# EasyEDA Pro project Pai_zhen_Pin.eprj

# Schematic Schematic1
Board Name: Board1; Create Date: 2026-05-11; Page Name: P1; Project Name: Pai_zhen_Pin; Schematic Name: Schematic1; Update Date: 2026-05-11; Company: 嘉立创EDA; Page Size: A4; Version: V1.0
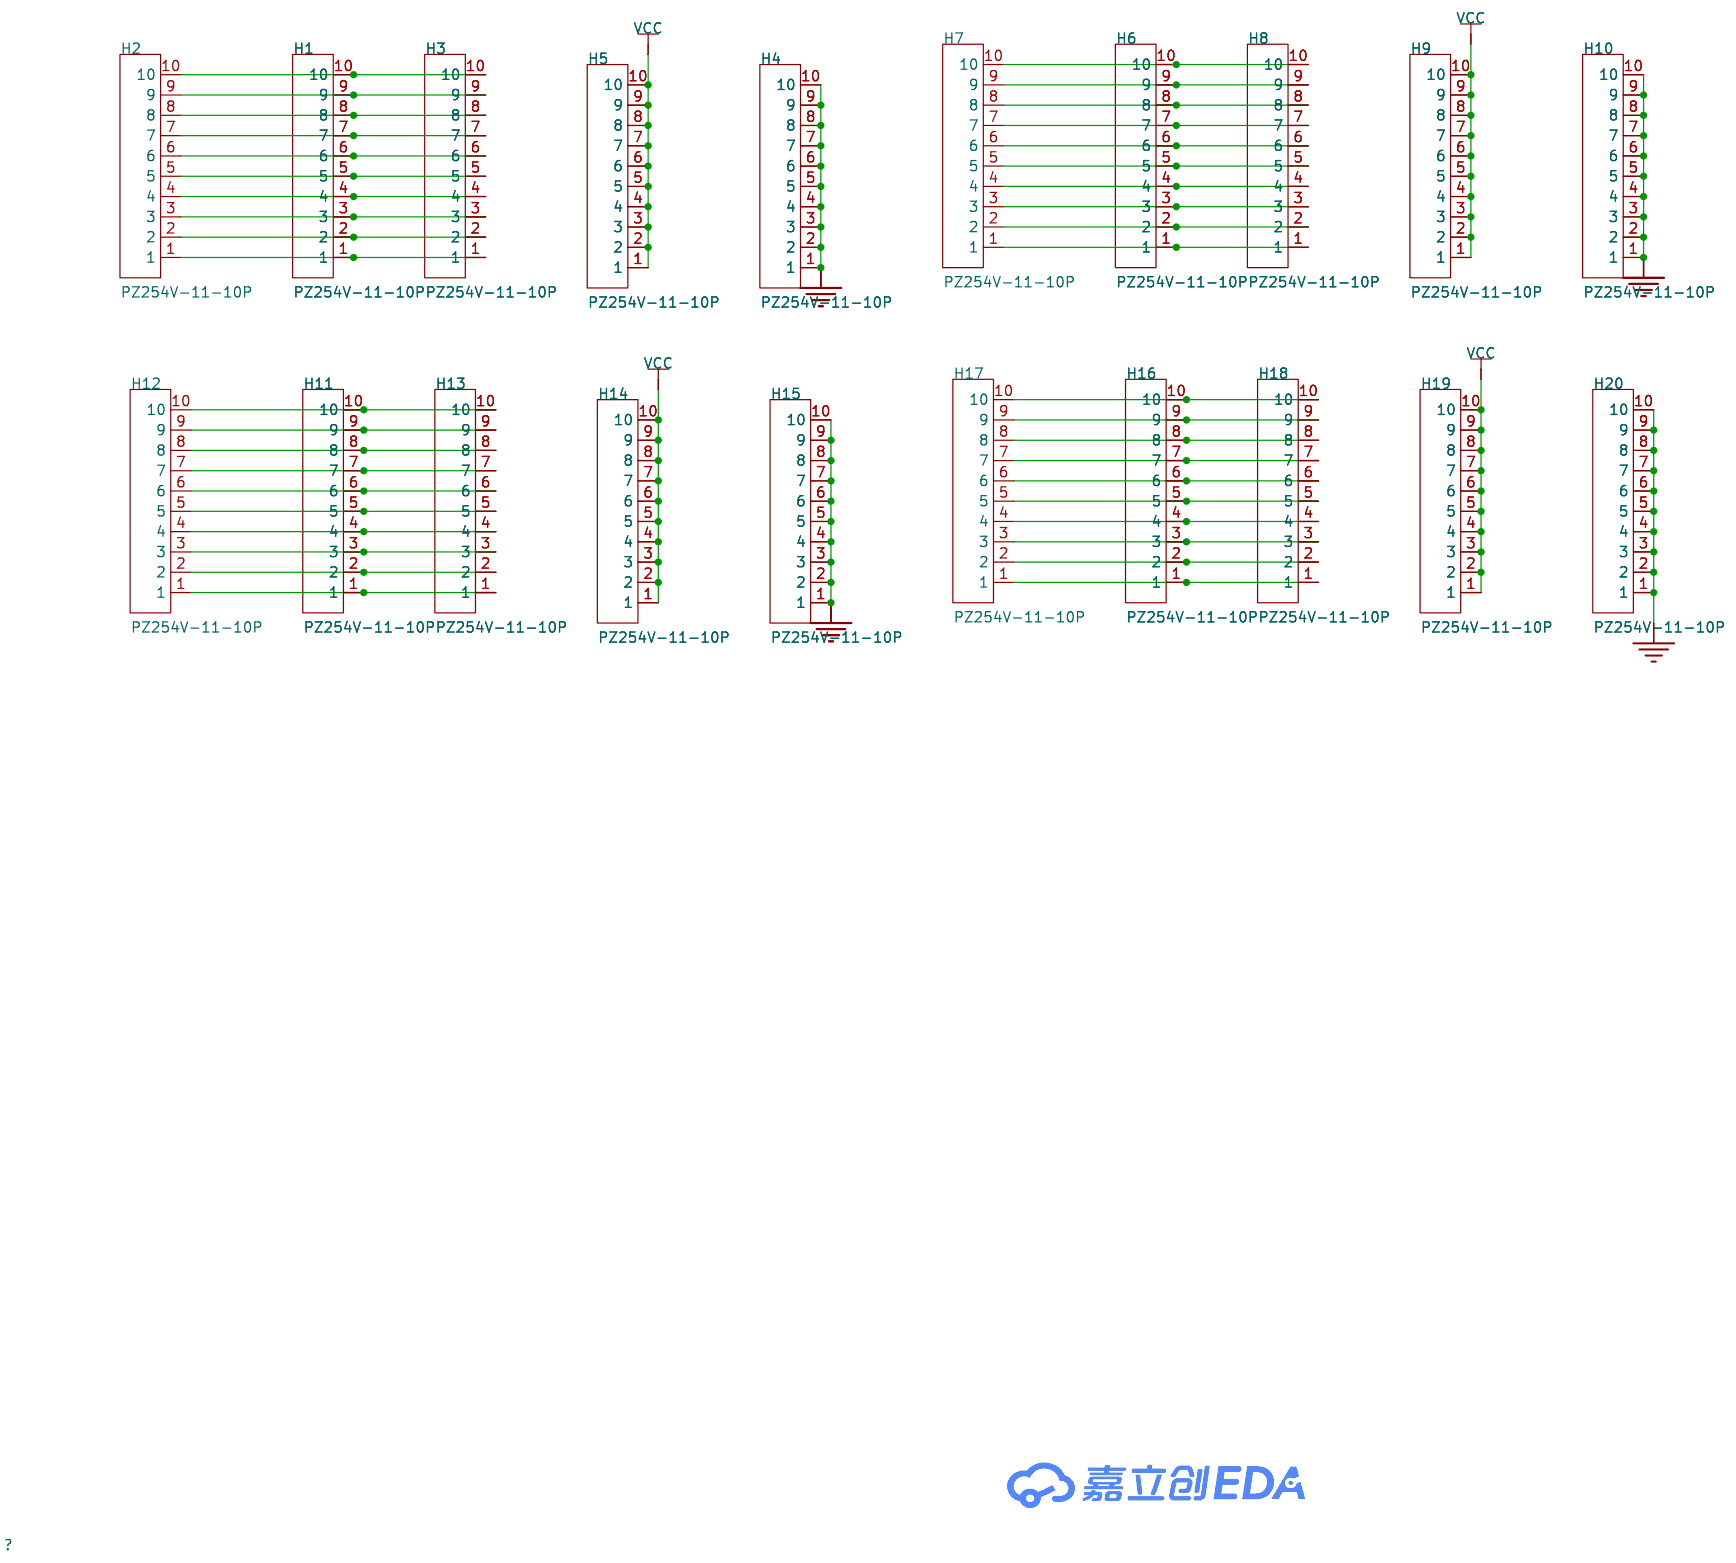
[diagram p0: schematic sheet]

## Parts
H1  PZ254V-11-10P  [HDR-TH_10P-P2.54-V-M]
H2  PZ254V-11-10P  [HDR-TH_10P-P2.54-V-M]
H3  PZ254V-11-10P  [HDR-TH_10P-P2.54-V-M]
H4  PZ254V-11-10P  [HDR-TH_10P-P2.54-V-M]
H5  PZ254V-11-10P  [HDR-TH_10P-P2.54-V-M]
H6  PZ254V-11-10P  [HDR-TH_10P-P2.54-V-M]
H7  PZ254V-11-10P  [HDR-TH_10P-P2.54-V-M]
H8  PZ254V-11-10P  [HDR-TH_10P-P2.54-V-M]
H9  PZ254V-11-10P  [HDR-TH_10P-P2.54-V-M]
H10  PZ254V-11-10P  [HDR-TH_10P-P2.54-V-M]
H11  PZ254V-11-10P  [HDR-TH_10P-P2.54-V-M]
H12  PZ254V-11-10P  [HDR-TH_10P-P2.54-V-M]
H13  PZ254V-11-10P  [HDR-TH_10P-P2.54-V-M]
H14  PZ254V-11-10P  [HDR-TH_10P-P2.54-V-M]
H15  PZ254V-11-10P  [HDR-TH_10P-P2.54-V-M]
H16  PZ254V-11-10P  [HDR-TH_10P-P2.54-V-M]
H17  PZ254V-11-10P  [HDR-TH_10P-P2.54-V-M]
H18  PZ254V-11-10P  [HDR-TH_10P-P2.54-V-M]
H19  PZ254V-11-10P  [HDR-TH_10P-P2.54-V-M]
H20  PZ254V-11-10P  [HDR-TH_10P-P2.54-V-M]

## Library data of the parts
H1-H20 = PZ254V-11-10P: LCSC Part Name: 1x10P 间距:2.54mm 方针 直插; Supplier Part: C492409; Manufacturer: XFCN(兴飞); Supplier Footprint: 插件,P=2.54mm; JLCPCB Part Class: 扩展库; Datasheet: https://item.szlcsc.com/datasheet/PZ254V-11-10P/502965.html; Supplier: LCSC; Pin Structure: 1x10P; Pitch: 2.54mm; Circluar Pins/Square Pins: 方针; Mounting Type: 直插; Number of Rows: 单排; Number of Pins: 10P; Current Rating: 3A; Voltage Rating (Max): 250V; Length of Mating Pin: 6mm; Insulation Height: 2.5mm; Length of End Connection Pin: 3mm; Contact Material: 黄铜; Operating Temperature: -40℃~+105℃; Color: 黑色

## Nets
GND: H4.1 H4.2 H4.3 H4.4 H4.5 H4.6 H4.7 H4.8 H4.9 H4.10 H10.1 H10.2 H10.3 H10.4 H10.5 H10.6 H10.7 H10.8 H10.9 H10.10 H15.1 H15.2 H15.3 H15.4 H15.5 H15.6 H15.7 H15.8 H15.9 H15.10 H20.1 H20.2 H20.3 H20.4 H20.5 H20.6 H20.7 H20.8 H20.9 H20.10
VCC: H5.1 H5.2 H5.3 H5.4 H5.5 H5.6 H5.7 H5.8 H5.9 H5.10 H9.1 H9.2 H9.3 H9.4 H9.5 H9.6 H9.7 H9.8 H9.9 H9.10 H14.1 H14.2 H14.3 H14.4 H14.5 H14.6 H14.7 H14.8 H14.9 H14.10 H19.1 H19.2 H19.3 H19.4 H19.5 H19.6 H19.7 H19.8 H19.9 H19.10
$1N1061: H1.10 H2.10 H3.10
$1N1066: H1.9 H2.9 H3.9
$1N1071: H1.8 H2.8 H3.8
$1N1076: H1.7 H2.7 H3.7
$1N1126: H1.6 H2.6 H3.6
$1N1138: H1.5 H2.5 H3.5
$1N1143: H1.4 H2.4 H3.4
$1N1170: H1.3 H2.3 H3.3
$1N1182: H1.2 H2.2 H3.2
$1N1195: H1.1 H2.1 H3.1
$1N2869: H6.1 H7.1 H8.1
$1N2872: H6.2 H7.2 H8.2
$1N2875: H6.8 H7.8 H8.8
$1N2878: H6.7 H7.7 H8.7
$1N2881: H6.6 H7.6 H8.6
$1N2884: H6.10 H7.10 H8.10
$1N2887: H6.9 H7.9 H8.9
$1N2890: H6.3 H7.3 H8.3
$1N2893: H6.5 H7.5 H8.5
$1N2896: H6.4 H7.4 H8.4
$1N3709: H16.6 H17.6 H18.6
$1N3712: H16.5 H17.5 H18.5
$1N3715: H16.4 H17.4 H18.4
$1N3718: H16.7 H17.7 H18.7
$1N3721: H16.3 H17.3 H18.3
$1N3724: H16.10 H17.10 H18.10
$1N3727: H16.9 H17.9 H18.9
$1N3730: H16.8 H17.8 H18.8
$1N3733: H16.1 H17.1 H18.1
$1N3736: H16.2 H17.2 H18.2
$1N3739: H11.1 H12.1 H13.1
$1N3742: H11.2 H12.2 H13.2
$1N3745: H11.8 H12.8 H13.8
$1N3748: H11.7 H12.7 H13.7
$1N3751: H11.6 H12.6 H13.6
$1N3754: H11.10 H12.10 H13.10
$1N3757: H11.9 H12.9 H13.9
$1N3760: H11.3 H12.3 H13.3
$1N3763: H11.5 H12.5 H13.5
$1N3766: H11.4 H12.4 H13.4

# Board PCB1
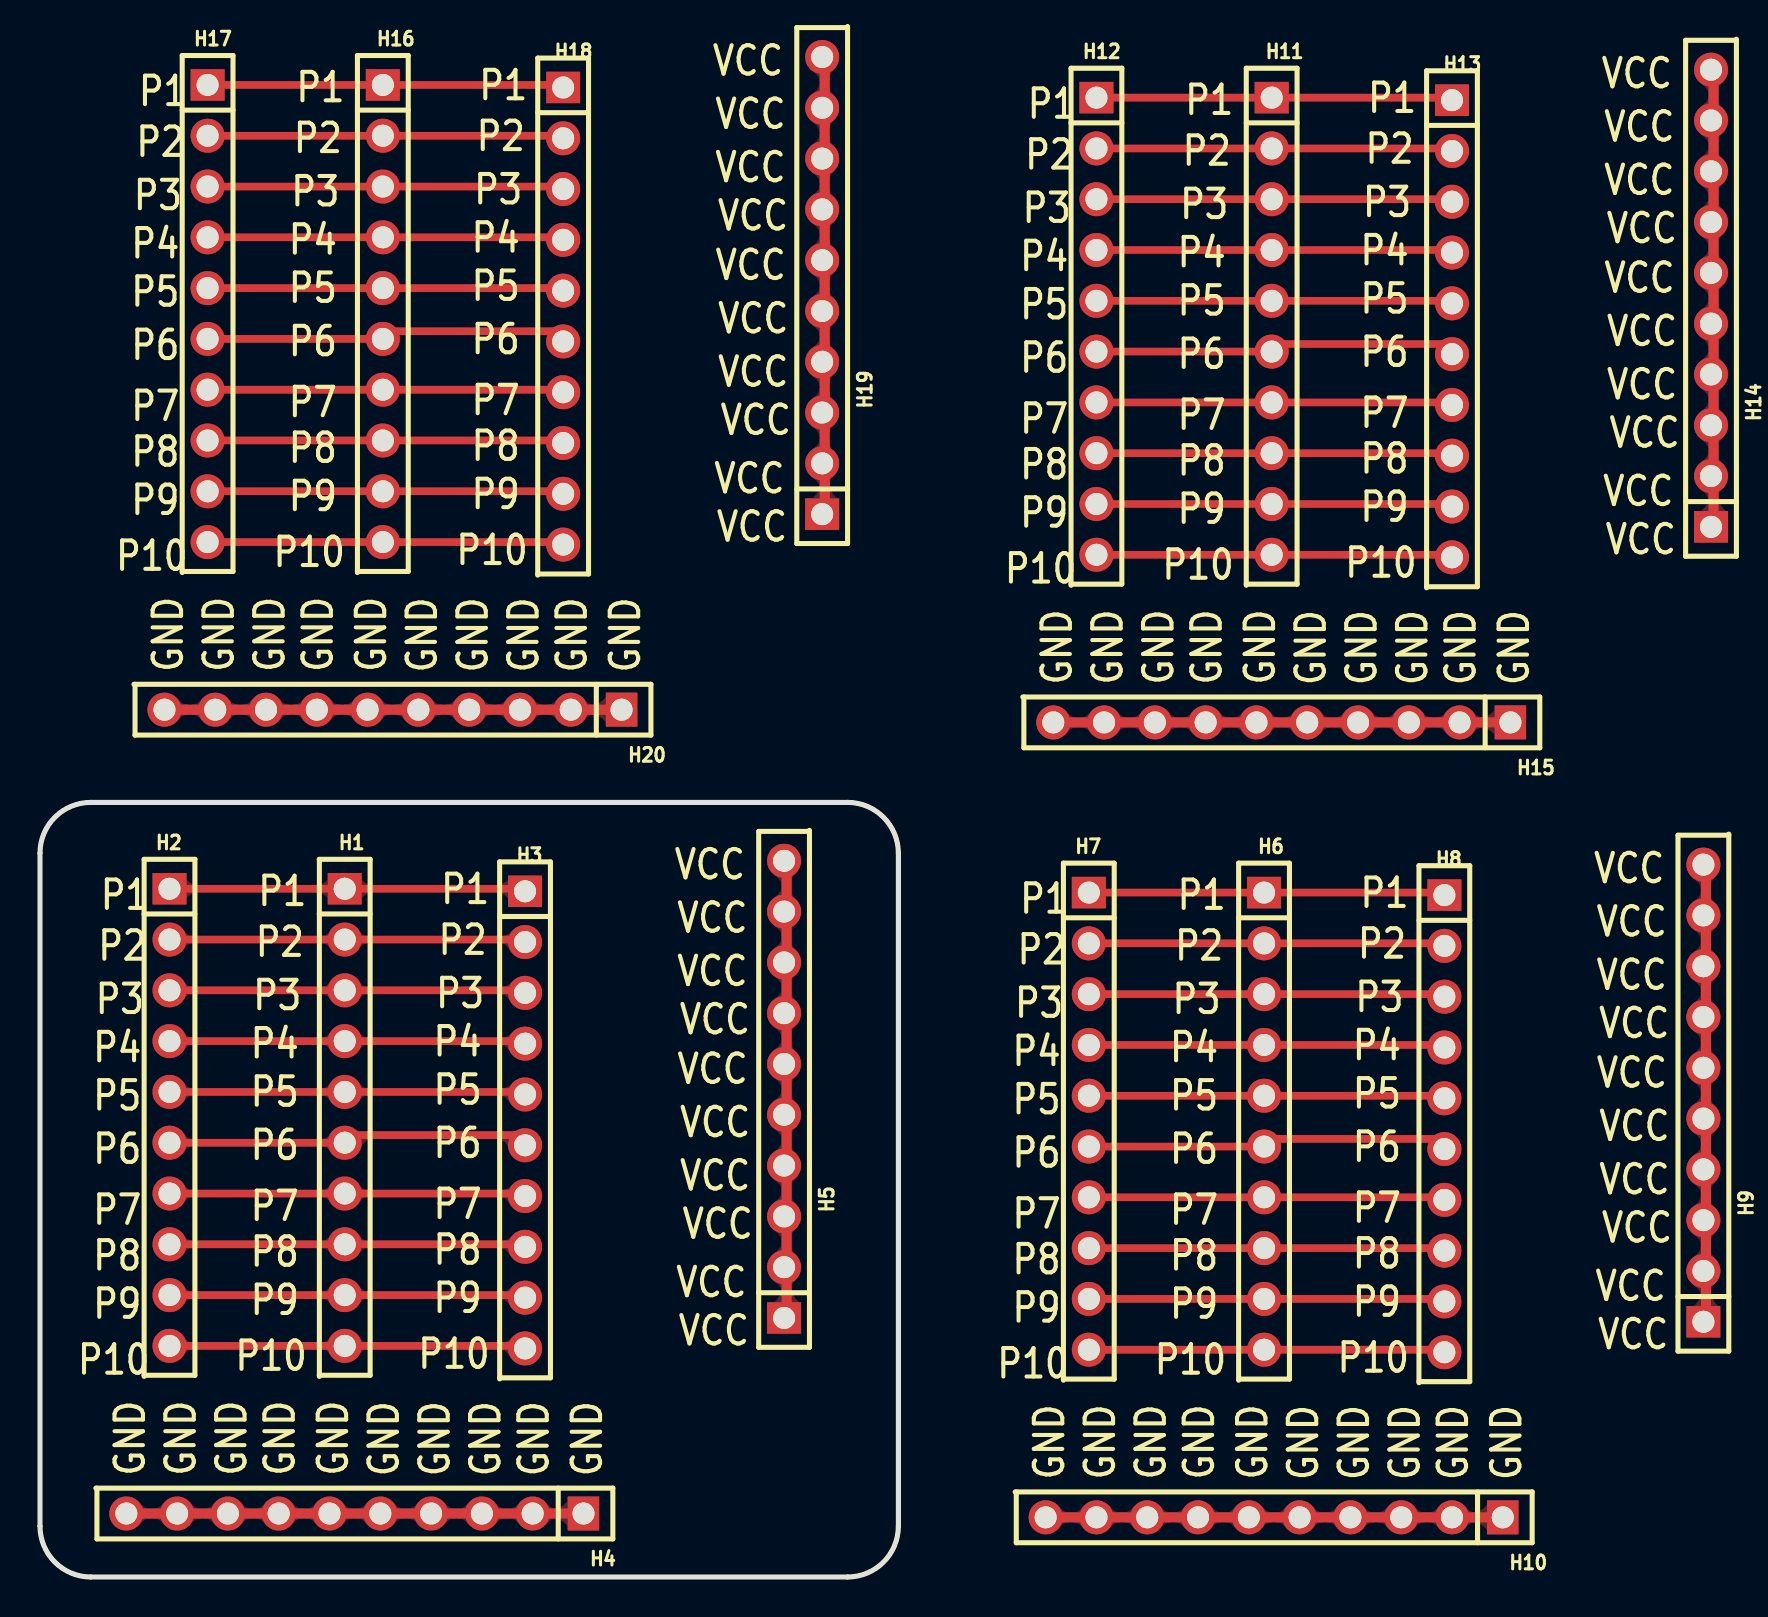
[diagram p1: board, top side]
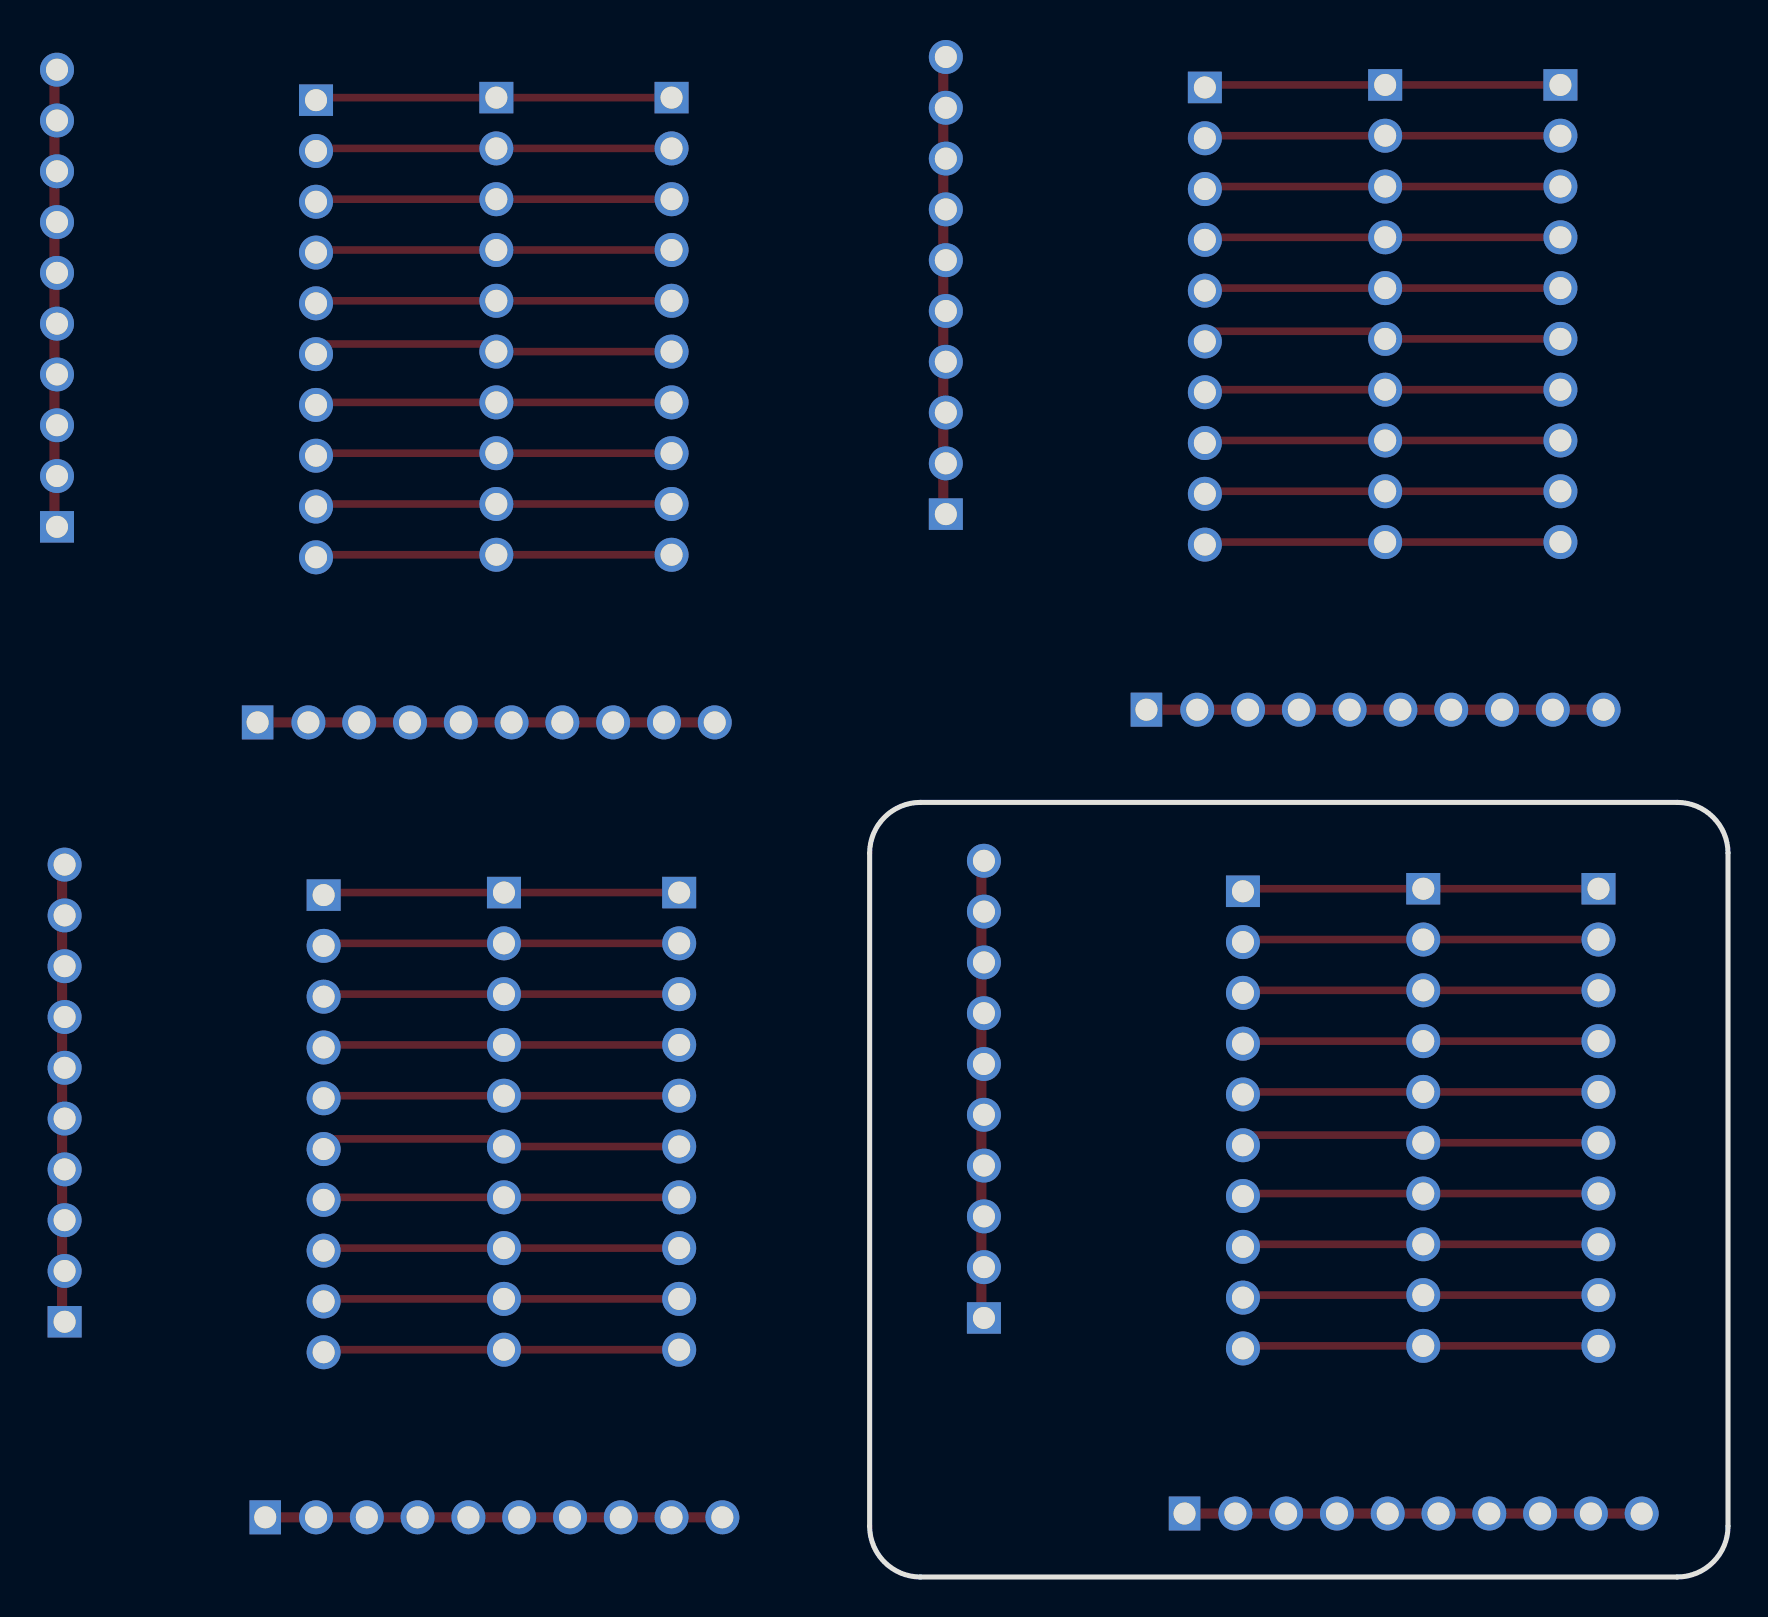
[diagram p2: board, bottom side, seen from below]

Outline 42.93 x 38.73 mm; copper layers: Top Layer, Bottom Layer. Coordinates in mm from the lower left corner of the outline.
Outline path: 0,36.19 0,2.54 arc(0.74,0.74) 2.54,0 40.39,0 arc(42.18,0.74) 42.93,2.54 42.93,36.19 arc(42.18,37.99) 40.39,38.73 2.54,38.73 arc(0.74,37.99) 0,36.19
Stack: Top Layer 0.035mm / Dielectric1 1.51mm FR4 er 4.5 / Bottom Layer 0.035mm

## Design rules (mm)
template: JLCPCB Capability(Two Layers Board)
spacing copperThickness1oz (default): track to track 0.102, other pairs 0.152 to 0.3
spacing copperThickness2oz: track to track 0.203, other pairs 0.152 to 0.3
track width copperThickness1oz (default): min 0.127, default 0.254, max 2.54
track width copperThickness2oz: min 0.203, default 0.254, max 2.54
differential pair differentialPair (default): width min 0.127, default 0.254, max 2.54; gap min 0.152, default 0.152
via viaSize (default): diameter min 0.5, default 0.61, max 10; hole min 0.3, default 0.305, max 6.3

## Placement (name value [footprint] x y rotation side)
H1  PZ254V-11-10P  [HDR-TH_10P-P2.54-V-M]  15.24 22.99 270 top
H2  PZ254V-11-10P  [HDR-TH_10P-P2.54-V-M]  6.48 22.99 270 top
H3  PZ254V-11-10P  [HDR-TH_10P-P2.54-V-M]  24.26 22.86 270 top
H4  PZ254V-11-10P  [HDR-TH_10P-P2.54-V-M]  15.75 3.17 180 top
H5  PZ254V-11-10P  [HDR-TH_10P-P2.54-V-M]  37.21 24.38 90 top
H6  PZ254V-11-10P  [HDR-TH_10P-P2.54-V-M]  61.21 22.8 270 top
H7  PZ254V-11-10P  [HDR-TH_10P-P2.54-V-M]  52.45 22.8 270 top
H8  PZ254V-11-10P  [HDR-TH_10P-P2.54-V-M]  70.23 22.67 270 top
H9  PZ254V-11-10P  [HDR-TH_10P-P2.54-V-M]  83.19 24.19 90 top
H10  PZ254V-11-10P  [HDR-TH_10P-P2.54-V-M]  61.72 2.98 180 top
H11  PZ254V-11-10P  [HDR-TH_10P-P2.54-V-M]  61.59 62.55 270 top
H12  PZ254V-11-10P  [HDR-TH_10P-P2.54-V-M]  52.83 62.55 270 top
H13  PZ254V-11-10P  [HDR-TH_10P-P2.54-V-M]  70.61 62.42 270 top
H14  PZ254V-11-10P  [HDR-TH_10P-P2.54-V-M]  83.57 63.94 90 top
H15  PZ254V-11-10P  [HDR-TH_10P-P2.54-V-M]  62.1 42.74 180 top
H16  PZ254V-11-10P  [HDR-TH_10P-P2.54-V-M]  17.15 63.18 270 top
H17  PZ254V-11-10P  [HDR-TH_10P-P2.54-V-M]  8.38 63.18 270 top
H18  PZ254V-11-10P  [HDR-TH_10P-P2.54-V-M]  26.16 63.06 270 top
H19  PZ254V-11-10P  [HDR-TH_10P-P2.54-V-M]  39.12 64.58 90 top
H20  PZ254V-11-10P  [HDR-TH_10P-P2.54-V-M]  17.65 43.37 180 top

## Footprints (pads in the part's own frame, mm; a bottom-side part is the same pattern mirrored in y, then rotated)
HDR-TH_10P-P2.54-V-M
  rect 1.575x1.7 hole 1.1: 1(-11.43,0)
  round 1.7 hole 1.1: 2(-8.89,0) 3(-6.35,0) 4(-3.81,0) 5(-1.27,0) 6(1.27,0) 7(3.81,0) 8(6.35,0) 9(8.89,0) 10(11.43,0)

## Nets
As in the schematic.

## Routing (per net, layer and track width the routed paths; a pad name or vN(x,y) marks a point on that pad's centre or on a via; arc(x,y) is an arc through that point)
GND: length 91.4
  Top Layer w0.508: H4.1 H4.2 H4.4 H4.5 H4.7 H4.8 4.32,3.17 ; H15.10 H15.9 H15.8 H15.7 H15.6 H15.5 H15.4 H15.3 H15.2 H15.1 ; 73.15,2.98 H10.2 H10.3 H10.4 H10.6 H10.7 H10.8 H10.10 ; H20.10 H20.9 H20.8 H20.7 H20.6 H20.5 H20.4 H20.3 H20.2 H20.1
VCC: length 91.4
  Top Layer w0.508: 37.34,35.81 37.34,12.95 ; 39.24,76.01 39.24,53.15 ; 83.31,35.62 83.31,12.76 ; 83.69,75.37 83.69,52.51
$1N1061: length 17.8
  Top Layer w0.381: H3.10 24.13,11.56 H1.10 H2.10
$1N1066: length 17.8
  Top Layer w0.381: H3.9 24.13,14.1 H1.9 H2.9
$1N1071: length 17.8
  Top Layer w0.381: H2.8 H1.8 24.13,16.64 H3.8
$1N1076: length 17.8
  Top Layer w0.381: H3.7 24.13,19.18 H1.7 H2.7
$1N1126: length 18.2
  Top Layer w0.381: H3.6 23.75,22.1 15.51,22.1 15.24,21.83 H1.6 H2.6
$1N1138: length 17.8
  Top Layer w0.381: H3.5 24.13,24.26 H1.5 H2.5
$1N1143: length 17.8
  Top Layer w0.381: H2.4 H1.4 24.13,26.8 H3.4
$1N1170: length 17.8
  Top Layer w0.381: H2.3 H1.3 24.13,29.34 H3.3
$1N1182: length 17.8
  Top Layer w0.381: H3.2 24.13,31.88 H1.2 H2.2
$1N1195: length 17.8
  Top Layer w0.381: H3.1 24.13,34.42 H1.1 H2.1
$1N2869: length 17.8
  Top Layer w0.381: H7.1 H6.1 70.1,34.23 H8.1
$1N2872: length 17.8
  Top Layer w0.381: H7.2 H6.2 70.1,31.69 H8.2
$1N2875: length 17.8
  Top Layer w0.381: H7.8 H6.8 70.1,16.45 H8.8
$1N2878: length 17.8
  Top Layer w0.381: H7.7 H6.7 70.1,18.99 H8.7
$1N2881: length 18.2
  Top Layer w0.381: H7.6 H6.6 61.21,21.64 61.48,21.91 69.72,21.91 H8.6
$1N2884: length 17.8
  Top Layer w0.381: H8.10 70.1,11.37 H6.10 H7.10
$1N2887: length 17.8
  Top Layer w0.381: H7.9 H6.9 70.1,13.91 H8.9
$1N2890: length 17.8
  Top Layer w0.381: H8.3 70.1,29.15 H6.3 H7.3
$1N2893: length 17.8
  Top Layer w0.381: H7.5 H6.5 70.1,24.07 H8.5
$1N2896: length 17.8
  Top Layer w0.381: H8.4 70.1,26.61 H6.4 H7.4
$1N3709: length 18.2
  Top Layer w0.381: H17.6 H16.6 17.15,62.02 17.41,62.29 25.65,62.29 H18.6
$1N3712: length 17.8
  Top Layer w0.381: H17.5 H16.5 26.03,64.45 H18.5
$1N3715: length 17.8
  Top Layer w0.381: H17.4 H16.4 26.03,66.99 H18.4
$1N3718: length 17.8
  Top Layer w0.381: H18.7 26.03,59.37 H16.7 H17.7
$1N3721: length 17.8
  Top Layer w0.381: H18.3 26.03,69.53 H16.3 H17.3
$1N3724: length 17.8
  Top Layer w0.381: H18.10 26.03,51.75 H16.10 H17.10
$1N3727: length 17.8
  Top Layer w0.381: H18.9 26.03,54.29 H16.9 H17.9
$1N3730: length 17.8
  Top Layer w0.381: H17.8 H16.8 26.03,56.83 H18.8
$1N3733: length 17.8
  Top Layer w0.381: H18.1 26.03,74.61 H16.1 H17.1
$1N3736: length 17.8
  Top Layer w0.381: H17.2 H16.2 26.03,72.07 H18.2
$1N3739: length 17.8
  Top Layer w0.381: H12.1 H11.1 70.49,73.98 H13.1
$1N3742: length 17.8
  Top Layer w0.381: H12.2 H11.2 70.49,71.44 H13.2
$1N3745: length 17.8
  Top Layer w0.381: H13.8 70.49,56.2 H11.8 H12.8
$1N3748: length 17.8
  Top Layer w0.381: H12.7 H11.7 70.49,58.74 H13.7
$1N3751: length 18.2
  Top Layer w0.381: H13.6 70.1,61.66 61.86,61.66 61.59,61.39 H11.6 H12.6
$1N3754: length 17.8
  Top Layer w0.381: H13.10 70.49,51.12 H11.10 H12.10
$1N3757: length 17.8
  Top Layer w0.381: H13.9 70.49,53.66 H11.9 H12.9
$1N3760: length 17.8
  Top Layer w0.381: H13.3 70.49,68.9 H11.3 H12.3
$1N3763: length 17.8
  Top Layer w0.381: H13.5 70.49,63.82 H11.5 H12.5
$1N3766: length 17.8
  Top Layer w0.381: H12.4 H11.4 70.49,66.36 H13.4

Small or netless copper shapes (teardrops, artwork), in the pictures only: 184 on Top Layer

## Text on the board
Top Silkscreen Layer: P10 | P4 | P5 | P6 | P7 | P8 | P9 | P3 | P2 | P1 | VCC | GND
